# Altium schematic sheet L293D.SchDoc
size A; SheetNumber: 1; SheetTotal: 1
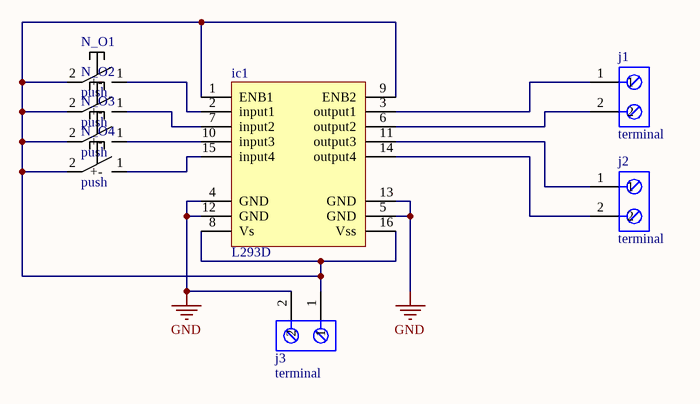
[diagram p0: L293D.SchDoc]

## Parts
ic1  L293D  [L293D]
j1  terminal  [terminal]
j2  terminal  [terminal]
j3  terminal  [terminal]
N_O1  push  [PUSH_BUTTON]
N_O2  push  [PUSH_BUTTON]
N_O3  push  [PUSH_BUTTON]
N_O4  push  [PUSH_BUTTON]

## Nets
GND: ic1.4(GND) ic1.5(GND) ic1.12(GND) ic1.13(GND) j3.2
Netic1_1: ic1.1(ENB1) ic1.8(Vs) ic1.9(ENB2) ic1.16(Vss) j3.1 N_O1.2(+) N_O2.2(+) N_O3.2(+) N_O4.2(+)
Netic1_2: ic1.2(input1) N_O1.1(-)
Netic1_3: ic1.3(output1) j1.1
Netic1_6: ic1.6(output2) j1.2
Netic1_7: ic1.7(input2) N_O2.1(-)
Netic1_10: ic1.10(input3) N_O3.1(-)
Netic1_11: ic1.11(output3) j2.1
Netic1_14: ic1.14(output4) j2.2
Netic1_15: ic1.15(input4) N_O4.1(-)

## Library data of the parts
ic1 = L293D: Half Bridge Based Peripheral Driver, 1.2A, PDIP16; Manufacturer: STMicroelectronics; Package Body Material: Plastic; Built-in Protections: TRANSIENT,THERMAL; Output Polarity: True; Input Characteristics: STANDARD; Channels: 2; Output Characteristics: 3-STATE; Output Current Flow Direction: SOURCE AND SINK; Supply Voltage1-Max: 36V; Supply Voltage1-Min: 4.5V; Supply Voltage1-Nom: 24V; Nominal Supply Voltage: 5V; Surface Mount: No; Qualification Status: Not Qualified; Supplier: Future Electronics; Supplier Part Number: 2116481; Manufacturer Part Number: L293D; RoHS: Yes; Category: Motor Drivers; Stock: 1325; Pricing: 25=4.14, 100=4.02, 375=3.9, 625=3.85, 1250=3.71 (USD); Case/Package: DIP; Pins: 16; Package Shape: Rectangular; Terminal Finish: Tin; JESD-609 Code: e3; Interface IC Type: HALF BRIDGE BASED PERIPHERAL DRIVER; JESD-30 Code: R-PDIP-T16; Output Peak Current Limit-Nom: 1.2A; Package Style: IN-LINEMeter; Max Supply Voltage: 36V; Min Supply Voltage: 4.5V; Terminal Form: Through Hole; Terminal Position: DUAL; Length: 20mm; Width: 7.62mm; Height - Seated (Max): 5.1mm; Terminal Pitch: 2.54mm; RoHS Compliant: Yes; Reach SVHC Compliant: No; ComponentLink1URL: https://datasheet.ciiva.com:443/pdfs/VipMasterIC/IC/SGST/SGSTS19357/SGSTS19357-1.pdf?src-supplier=IHS+Markit; ComponentLink1Description: https://datasheet.ciiva.com:443/pdfs/VipMasterIC/IC/SGST/SGSTS19357/SGSTS19357-1.pdf?src-supplier=IHS+Markit; ComponentLink2URL: https://datasheet.ciiva.com/14150/ocl293d-647107-dat-en-14150297.pdf?src-supplier=Distrelec; ComponentLink2Description: https://datasheet.ciiva.com/14150/ocl293d-647107-dat-en-14150297.pdf?src-supplier=Distrelec; ComponentLink3URL: https://datasheet.ciiva.com/29307/156134-da-01-en-4-kanal-treiber-ic-l293d-stm-29307000.pdf?src-supplier=Conrad; ComponentLink3Description: https://datasheet.ciiva.com/29307/156134-da-01-en-4-kanal-treiber-ic-l293d-stm-29307000.pdf?src-supplier=Conrad; ComponentLink4URL: https://datasheet.ciiva.com/1955/cd00000059-1955400.pdf?src-supplier=Digikey; ComponentLink4Description: https://datasheet.ciiva.com/1955/cd00000059-1955400.pdf?src-supplier=Digikey; ComponentLink5URL: https://datasheet.ciiva.com/4895/cd00000059-4895945.pdf?src-supplier=Mouser; ComponentLink5Description: https://datasheet.ciiva.com/4895/cd00000059-4895945.pdf?src-supplier=Mouser; ComponentLink6URL: https://datasheet.ciiva.com/16458/cd00000059-16458220.pdf?src-supplier=Future+Electronics; ComponentLink6Description: https://datasheet.ciiva.com/16458/cd00000059-16458220.pdf?src-supplier=Future+Electronics
j1-j3 = 691137710002: Barrier Strip Terminal Block; Manufacturer: Wurth Electronics; Supplier: Rs; Supplier Part Number: 1769908; Manufacturer Part Number: 691137710002; RoHS: No; Category: Terminal Blocks; Stock: 355; Pricing: 500=0.218, 1000=0.202, 2500=0.189 (GBP); RoHS Compliant: Yes; ComponentLink1URL: https://datasheet.ciiva.com:443/pdfs/VipMasterIC/IC/MIDC/MIDC-S-A0005074262/MIDC-S-A0004711666-1.pdf?src-supplier=IHS+Markit; ComponentLink1Description: https://datasheet.ciiva.com:443/pdfs/VipMasterIC/IC/MIDC/MIDC-S-A0005074262/MIDC-S-A0004711666-1.pdf?src-supplier=IHS+Markit; ComponentLink2URL: https://katalog.we-online.de/em/datasheet/691137710002.pdf?src-supplier=Digikey; ComponentLink2Description: https://katalog.we-online.de/em/datasheet/691137710002.pdf?src-supplier=Digikey
N_O1-N_O4 = 800CSP1B6M2QE: Pushbutton Switch; Manufacturer: E-Switch; Supplier: Digikey; Supplier Part Number: EG5543-ND; Manufacturer Part Number: 800CSP1B6M2QE; RoHS: No; Category: Pushbutton Switches; Stock: 192; Pricing: 1=2.89, 10=2.582, 25=2.446, 50=2.3596, 100=2.2361, 270=2.175 (USD); Reach SVHC Compliant: Yes; ComponentLink1URL: https://www.e-switch.com/system/asset/product_line/data_sheet/214/800C.pdf?src-supplier=Digikey; ComponentLink1Description: https://www.e-switch.com/system/asset/product_line/data_sheet/214/800C.pdf?src-supplier=Digikey